# Altium schematic sheet Connection.SchDoc
size 381 x 241 mm
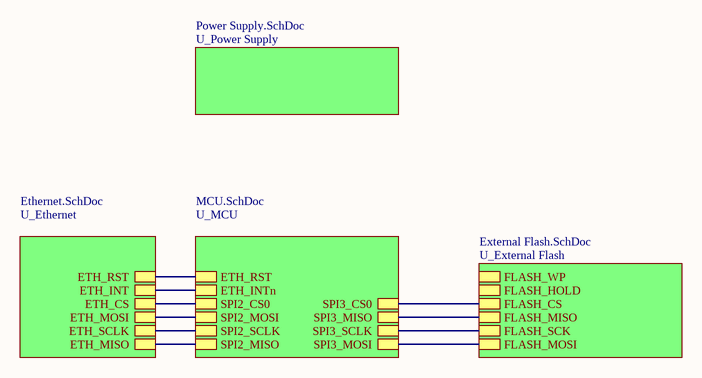
[diagram p0: Connection.SchDoc]

## Sub-sheets
U_Ethernet = Ethernet.SchDoc: ETH_MISO, ETH_MOSI, ETH_CS, ETH_INT, ETH_RST, ETH_SCLK
U_External Flash = External Flash.SchDoc: FLASH_CS, FLASH_MISO, FLASH_WP, FLASH_HOLD, FLASH_SCK, FLASH_MOSI
U_MCU = MCU.SchDoc: SPI3_MOSI, SPI3_MISO, SPI3_SCLK, SPI3_CS0, SPI2_CS0, SPI2_MOSI, SPI2_SCLK, SPI2_MISO, ETH_RST, ETH_INTn
U_Power Supply = Power Supply.SchDoc: no entries

## Nets
(unnamed): sheet U_MCU/SPI3_MOSI, sheet U_External Flash/FLASH_MOSI
(unnamed): sheet U_MCU/SPI3_MISO, sheet U_External Flash/FLASH_MISO
(unnamed): sheet U_MCU/SPI3_SCLK, sheet U_External Flash/FLASH_SCK
(unnamed): sheet U_MCU/SPI3_CS0, sheet U_External Flash/FLASH_CS
(unnamed): sheet U_MCU/SPI2_CS0, sheet U_Ethernet/ETH_CS
(unnamed): sheet U_MCU/SPI2_MOSI, sheet U_Ethernet/ETH_MOSI
(unnamed): sheet U_MCU/SPI2_SCLK, sheet U_Ethernet/ETH_SCLK
(unnamed): sheet U_MCU/SPI2_MISO, sheet U_Ethernet/ETH_MISO
(unnamed): sheet U_MCU/ETH_RST, sheet U_Ethernet/ETH_RST
(unnamed): sheet U_MCU/ETH_INTn, sheet U_Ethernet/ETH_INT